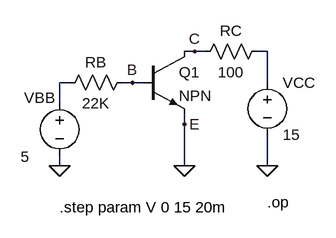
[diagram p0: schematic transistor.asc]
transistor.asc, the LTspice schematic file:
Version 4
SHEET 1 880 680
WIRE 320 48 304 48
WIRE 336 48 320 48
WIRE 432 48 416 48
WIRE 128 96 112 96
WIRE 224 96 208 96
WIRE 240 96 224 96
WIRE 432 96 432 48
WIRE 112 128 112 96
WIRE 304 160 304 144
WIRE 112 224 112 208
WIRE 304 224 304 160
WIRE 432 224 432 176
FLAG 112 224 0
FLAG 304 224 0
FLAG 432 224 0
FLAG 224 96 B
FLAG 320 48 C
FLAG 304 160 E
SYMBOL res 224 80 R90
WINDOW 0 0 56 VBottom 2
WINDOW 3 32 56 VTop 2
SYMATTR InstName RB
SYMATTR Value 22K
SYMBOL res 432 32 R90
WINDOW 0 0 56 VBottom 2
WINDOW 3 32 56 VTop 2
SYMATTR InstName RC
SYMATTR Value 100
SYMBOL voltage 112 112 R0
WINDOW 0 -55 7 Left 2
WINDOW 3 -60 98 Left 2
WINDOW 123 0 0 Left 0
WINDOW 39 0 0 Left 0
SYMATTR InstName VBB
SYMATTR Value 5
SYMBOL voltage 432 80 R0
SYMATTR InstName VCC
SYMATTR Value 15
SYMBOL npn 240 48 R0
SYMATTR InstName Q1
TEXT 112 288 Left 2 !.step param V 0 15 20m
TEXT 432 280 Left 2 !.op

The netlist it stands for:
* transistor.asc
RB B N002 22K
RC N001 C 100
VBB N002 0 5
VCC N001 0 15
Q1 C B 0 0 NPN
.model NPN NPN
.model PNP PNP
.lib standard.bjt
.step param V 0 15 20m
.op
.backanno
.end